# Altium schematic sheet [02] Seven Segment.SchDoc: Design 1
size Tabloid; Engineer: The ASID Designer; Organization: ASID Designer; Address1: Iran; Address2: Shiraz; Address3: P.O.Box 71765-385; DocumentNumber: 1; Revision: 1.0; SheetNumber: 1; SheetTotal: 1
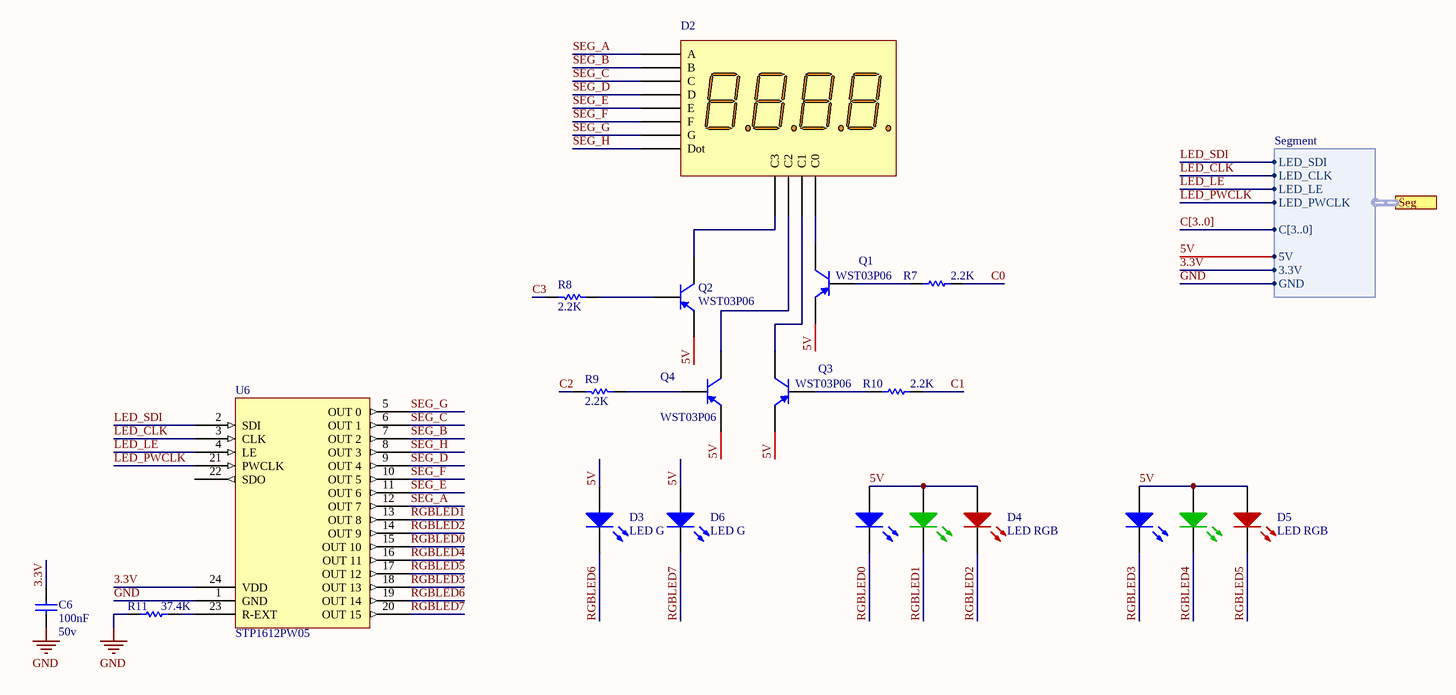
[diagram p0: [02] Seven Segment.SchDoc]

## Parts
C6  Volte: 50v  [MY_0603]  (hidden comment: 100nF)
D2  comon anode 4x7 segment  [MY_4X7_seg]  (value not drawn)
D3  LED G  [MY_LED_0805]
D4  LED RGB  [MY_RGB5050]
D5  LED RGB  [MY_RGB5050]
D6  LED G  [MY_LED_0805]
Q1  WST03P06  [SOT-23A_N]
Q2  WST03P06  [SOT-23A_N]
Q3  WST03P06  [SOT-23A_N]
Q4  WST03P06  [SOT-23A_N]
R7  2.2K  [MY_0805]
R8  2.2K  [MY_0805]
R9  2.2K  [MY_0805]
R10  2.2K  [MY_0805]
R11  37.4K  [MY_0603]
U6  STP1612PW05  [MY_SOIC24]

## Ports
Seg (harness Segment)

## Harnesses
Segment: C[3..0], 5V, LED_SDI, LED_CLK, LED_LE, LED_PWCLK, 3.3V, GND

## Nets
GND: C6.1 R11.1 U6.1(GND) ; port Seg.GND
3.3V: C6.2 U6.24(VDD) ; port Seg.3.3V
5V: D3.A D4.AB(A) D4.AG(A) D4.AR(A) D5.AB(A) D5.AG(A) D5.AR(A) D6.A Q1.2(E) Q2.2(E) Q3.2(E) Q4.2(E) ; port Seg.5V
C0: R7.2
C1: R10.2
C2: R9.2
C3: R8.2
LED_CLK: U6.3(CLK) ; port Seg.LED_CLK
LED_LE: U6.4(LE) ; port Seg.LED_LE
LED_PWCLK: U6.21(PWCLK) ; port Seg.LED_PWCLK
LED_SDI: U6.2(SDI) ; port Seg.LED_SDI
RGBLED0: D4.KB(K) U6.15(OUT_10)
RGBLED1: D4.KG(K) U6.13(OUT_8)
RGBLED2: D4.KR(K) U6.14(OUT_9)
RGBLED3: D5.KB(K) U6.18(OUT_13)
RGBLED4: D5.KG(K) U6.16(OUT_11)
RGBLED5: D5.KR(K) U6.17(OUT_12)
RGBLED6: D3.K U6.19(OUT_14)
RGBLED7: D6.K U6.20(OUT_15)
SEG_A: D2.11(A) U6.12(OUT_7)
SEG_B: D2.7(B) U6.7(OUT_2)
SEG_C: D2.4(C) U6.6(OUT_1)
SEG_D: D2.2(D) U6.9(OUT_4)
SEG_E: D2.1(E) U6.11(OUT_6)
SEG_F: D2.10(F) U6.10(OUT_5)
SEG_G: D2.5(G) U6.5(OUT_0)
SEG_H: D2.3(Dot) U6.8(OUT_3)
NetD2_6: D2.6(C3) Q2.3(C)
NetD2_8: D2.8(C2) Q4.3(C)
NetD2_9: D2.9(C1) Q3.3(C)
NetD2_12: D2.12(C0) Q1.3(C)
NetQ1_1: Q1.1(B) R7.1
NetQ2_1: Q2.1(B) R8.1
NetQ3_1: Q3.1(B) R10.1
NetQ4_1: Q4.1(B) R9.1
NetR11_2: R11.2 U6.23(R-EXT)

Not connected (* = marked no-connect by the designer): U6 22(SDO)

## Buses and harness runs
bus C[3..0]

## Notes on the sheet
- Title
- Engineer:
- Date:
- Ali Asadzadeh
- Time:
- Number:
- Sheet
- Revision:
- of
- www.ASiDesigner.com
- Designed In Shiraz
- ASiD Designer
- File:

## Library data of the parts
C6 = Cap ceramic: None polar capacitor; ASiD Part Number: C-AS; Value: 100nF
D2 = 4x7 segment: ASiD Part Number: -AS
D3 D6 = LED: Typical INFRARED GaAs LED; ASiD Part Number: LED-AS
D4 D5 = LED RGB: Enhanced Power RGB LED; ASiD Part Number: RGB LED
Q1-Q4 = BC807-16: PNP General Purpose Amplifier; Published: 8-Jun-2000; LatestRevisionDate: 20-Nov-2009; LatestRevisionNote: IPC-7351 Footprint Added.; DatasheetVersion: 1997; PackageVersion: Sep-1998; PackageReference: SOT-23A; Publisher: Altium Limited; PackageDescription: 3-Pin SOT-23 Package 0.95 mm Pitch, 2.3 mm Lead Span; ComponentLink1Description: Manufacturer Link; ComponentLink1URL: http://www.fairchildsemi.com/; ComponentLink2Description: Datasheet; ComponentLink2URL: http://www.fairchildsemi.com/ds/BC%2FBC807.pdf
R7-R11 = Res: Standard resistor; ASiD Part Number: Res-AS
  R7-R10: Value: 2.2K
  R11: Value: 37.4K
U6 = STP1612PW05: 16-channel LED driver with 16-bit PWM